# Altium project gydrodrive_control_board.PrjPcb (part 1 of 2)
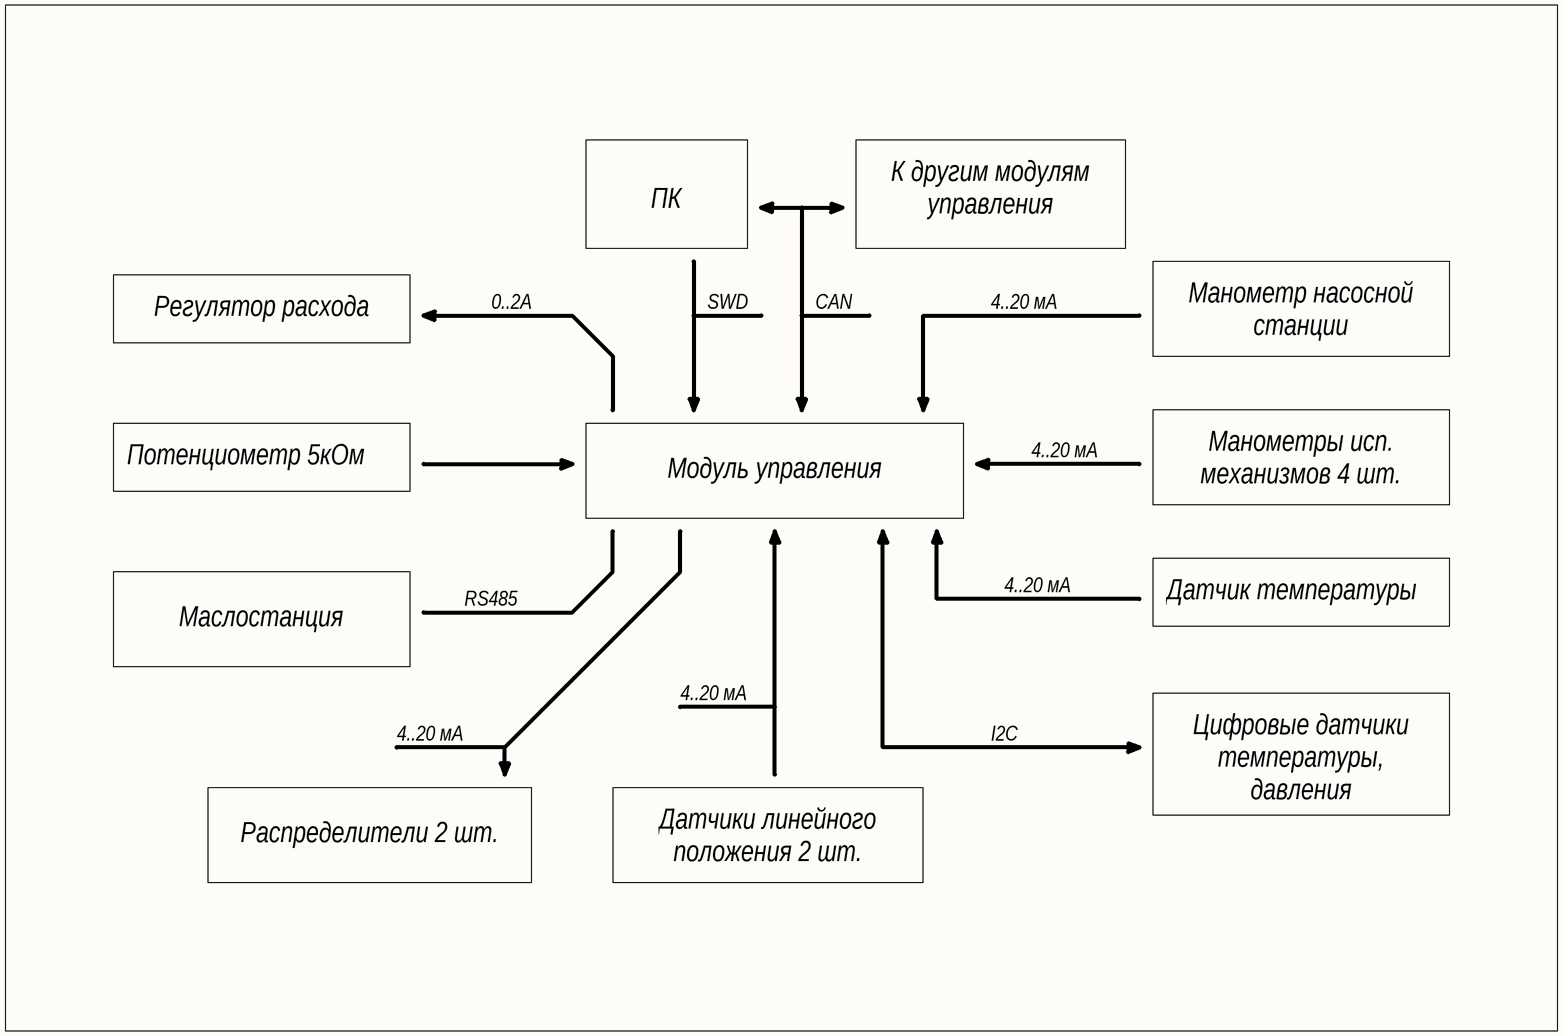
[diagram p0: gydrodrive_blockDiagram.SchDoc]
22 sheets, 283 parts. Net scope: strictly hierarchical (ports join the sheet entries above them; power ports are local).
Board file: gydrodrive_control_revA.PcbDoc
Sheets:
  gydrodrive_blockDiagram.SchDoc
  gydrodrive_main.SchDoc
    M = gydrodrive_mcu.SchDoc
    SP = gydrodrive_supply.SchDoc
    DB = gydrodrive_debugger.SchDoc
    B1 = gydrodrive_button.SchDoc
    B2 = gydrodrive_button.SchDoc
    B3 = gydrodrive_button.SchDoc
    B4 = gydrodrive_button.SchDoc
    B5 = gydrodrive_button.SchDoc
    B6 = gydrodrive_button.SchDoc
    P = gydrodrive_inputTrim.SchDoc
    C1 = gydrodrive_control.SchDoc
    C2 = gydrodrive_control.SchDoc
    IND = gydrodrive_indication.SchDoc
    D = gydrodrive_discreteControl.SchDoc
    S = gydrodrive_sto.SchDoc
    CS = gydrodrive_currentSource.SchDoc
    I = gydrodrive_interfaces.SchDoc
      I = gydrodrive_i2c.SchDoc
      U = gydrodrive_uart.SchDoc
      R = gydrodrive_rs485.SchDoc
      C = gydrodrive_can.SchDoc
    S = gydrodrive_sensors.SchDoc
      SPR1 = gydrodrive_sensor.SchDoc
      SPR2 = gydrodrive_sensor.SchDoc
      SPR3 = gydrodrive_sensor.SchDoc
      SPR4 = gydrodrive_sensor.SchDoc
      SPR5 = gydrodrive_sensor.SchDoc
      L1 = gydrodrive_linearPosSensor.SchDoc
      L2 = gydrodrive_linearPosSensor.SchDoc
      SPT = gydrodrive_sensor.SchDoc
    RS = gydrodrive_reservedPins.SchDoc
    EN = gydrodrive_encoder.SchDoc

## Sheet gydrodrive_blockDiagram.SchDoc
size A4; SheetNumber: 1; SheetTotal: 22

### Notes on the sheet
- ПК
- К другим модулям управления
- 0..2А
- SWD
- CAN
- 4..20 мА
- Регулятор расхода
- Манометр насосной станции
- Потенциометр 5кОм
- Модуль управления
- Манометры исп. механизмов 4 шт.
- RS485
- Датчик температуры
- Маслостанция
- I2C
- Цифровые датчики температуры, давления
- Распределители 2 шт.
- Датчики линейного положения 2 шт.

## Sheet gydrodrive_main.SchDoc
size 297 x 209 mm; SheetNumber: 2; SheetTotal: 22
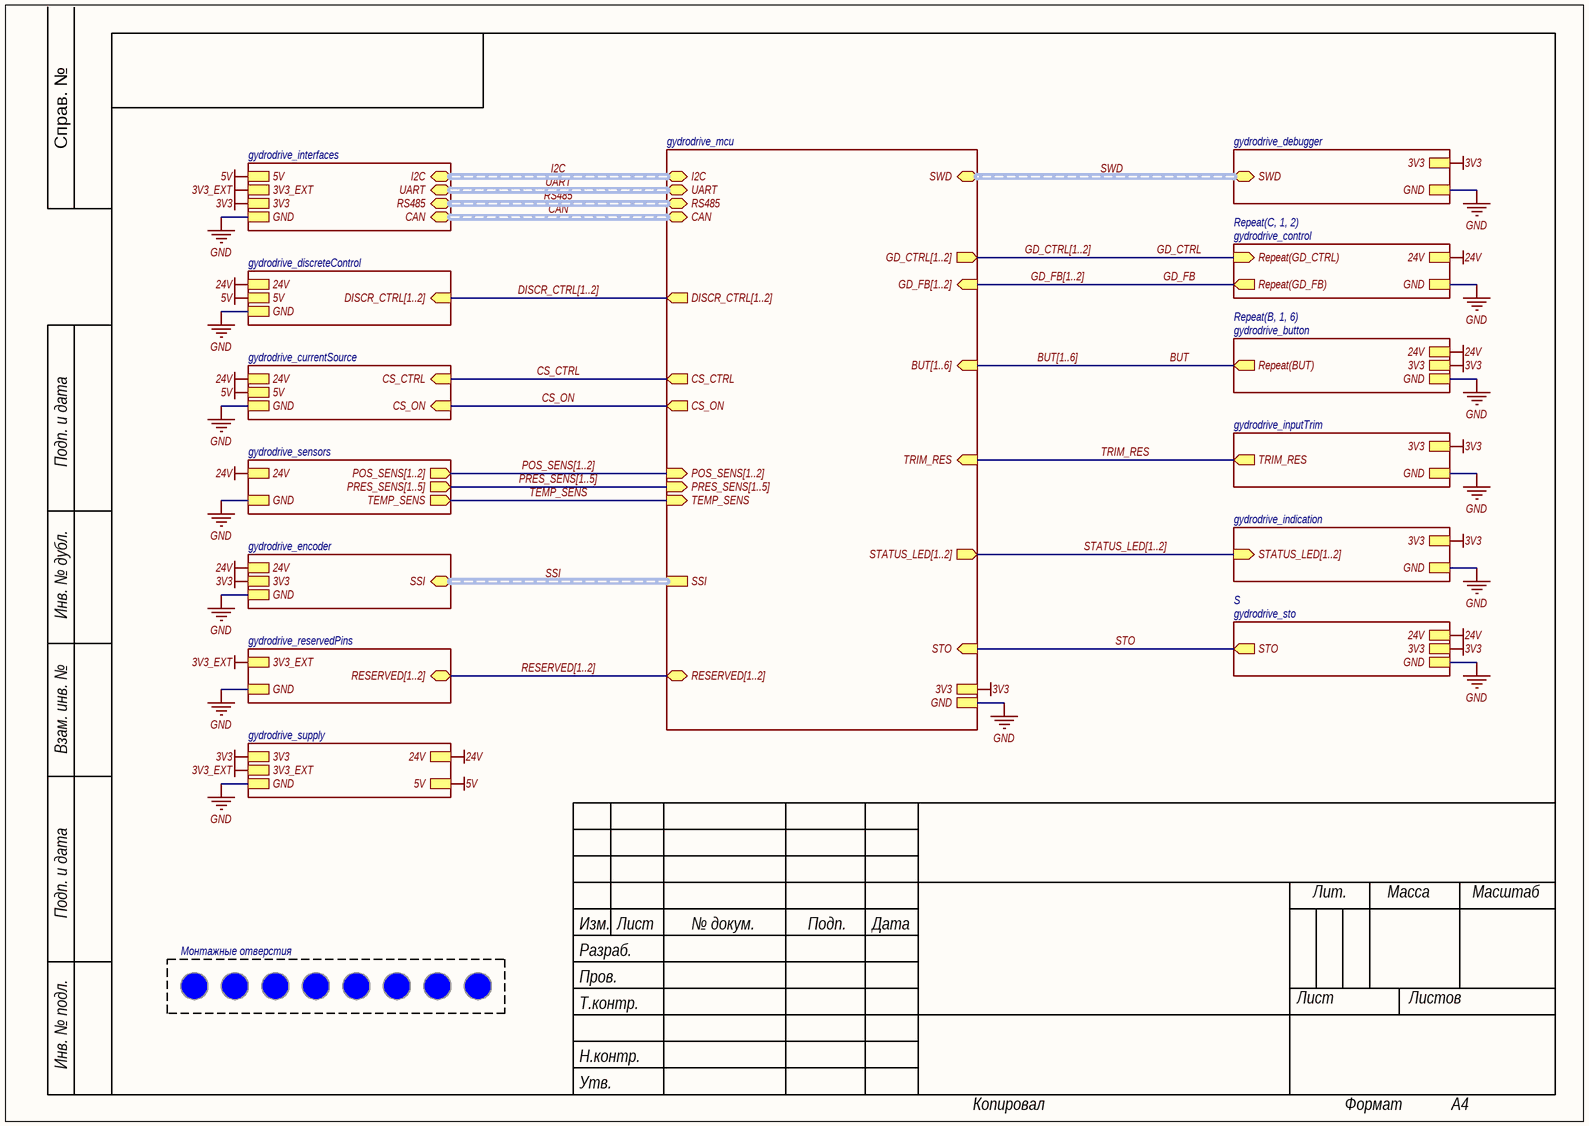
[diagram p1: gydrodrive_main.SchDoc]

### Parts
MH1  MH_3.2  [MH_3.2]  (value not drawn)  (no BOM)
MH2  MH_3.2  [MH_3.2]  (value not drawn)  (no BOM)
MH3  MH_3.2  [MH_3.2]  (value not drawn)  (no BOM)
MH4  MH_3.2  [MH_3.2]  (value not drawn)  (no BOM)
MH5  MH_3.2  [MH_3.2]  (value not drawn)  (no BOM)
MH6  MH_3.2  [MH_3.2]  (value not drawn)  (no BOM)
MH7  MH_3.2  [MH_3.2]  (value not drawn)  (no BOM)
MH8  MH_3.2  [MH_3.2]  (value not drawn)  (no BOM)

### Blocks framed on the sheet
Монтажные отверстия: MH1-MH8

### Sub-sheets
CS = gydrodrive_currentSource: CS_CTRL (in), 24V, GND, CS_ON (in), 5V
D = gydrodrive_discreteControl: 24V, GND, DISCR_CTRL[1..2] (in), 5V
DB = gydrodrive_debugger: SWD (bidir, harness SWD), GND, 3V3
EN = gydrodrive_encoder: SSI (bidir, harness SSI), 3V3, GND, 24V
I = gydrodrive_interfaces: CAN (bidir, harness CAN), RS485 (bidir, harness RS485), UART (bidir, harness UART), I2C (bidir, harness I2C), GND, 5V, 3V3, 3V3_EXT
IND = gydrodrive_indication: STATUS_LED[1..2] (in), GND, 3V3
M = gydrodrive_mcu: I2C (bidir, harness I2C), UART (bidir, harness UART), RS485 (bidir, harness RS485), CAN (bidir, harness CAN), TRIM_RES (in), BUT[1..6] (in), 3V3, GND, STATUS_LED[1..2] (out), STO (in), DISCR_CTRL[1..2] (out), SWD (bidir, harness SWD), GD_FB[1..2] (in), GD_CTRL[1..2] (out), CS_CTRL (out), POS_SENS[1..2] (in), PRES_SENS[1..5] (in), TEMP_SENS (in), CS_ON (out), RESERVED[1..2] (bidir), SSI (harness SSI)
P = gydrodrive_inputTrim: TRIM_RES (out), 3V3, GND
Repeat(B, 1, 6) = gydrodrive_button: Repeat(BUT) (out), 24V, GND, 3V3
Repeat(C, 1, 2) = gydrodrive_control: Repeat(GD_CTRL) (in), Repeat(GD_FB) (out), GND, 24V
RS = gydrodrive_reservedPins: GND, 3V3_EXT, RESERVED[1..2] (bidir)
S = gydrodrive_sto: STO (out), 24V, GND, 3V3
S = gydrodrive_sensors: PRES_SENS[1..5] (out), TEMP_SENS (out), POS_SENS[1..2] (out), 24V, GND
SP = gydrodrive_supply: 5V, GND, 3V3, 24V, 3V3_EXT

### Nets
3V3: sheet M/3V3, sheet SP/3V3, sheet DB/3V3, sheet Repeat(B, 1, 6)/3V3, sheet P/3V3, sheet IND/3V3, sheet S/3V3, sheet I/3V3, sheet EN/3V3
3V3_EXT: sheet SP/3V3_EXT, sheet I/3V3_EXT, sheet RS/3V3_EXT
5V: sheet SP/5V, sheet D/5V, sheet CS/5V, sheet I/5V
24V: sheet SP/24V, sheet Repeat(B, 1, 6)/24V, sheet Repeat(C, 1, 2)/24V, sheet D/24V, sheet S/24V, sheet CS/24V, sheet S/24V, sheet EN/24V
GND: sheet M/GND, sheet SP/GND, sheet DB/GND, sheet Repeat(B, 1, 6)/GND, sheet P/GND, sheet Repeat(C, 1, 2)/GND, sheet IND/GND, sheet D/GND, sheet S/GND, sheet CS/GND, sheet I/GND, sheet S/GND, sheet RS/GND, sheet EN/GND
BUT: sheet Repeat(B, 1, 6)/Repeat(BUT)
CS_CTRL: sheet M/CS_CTRL, sheet CS/CS_CTRL
CS_ON: sheet M/CS_ON, sheet CS/CS_ON
GD_CTRL: sheet Repeat(C, 1, 2)/Repeat(GD_CTRL)
GD_FB: sheet Repeat(C, 1, 2)/Repeat(GD_FB)
STO: sheet M/STO, sheet S/STO
TEMP_SENS: sheet M/TEMP_SENS, sheet S/TEMP_SENS
TRIM_RES: sheet M/TRIM_RES, sheet P/TRIM_RES

### Buses and harness runs
bus BUT[1..6] = sheet M/BUT[1..6]
bus DISCR_CTRL[1..2] = sheet D/DISCR_CTRL[1..2] = sheet M/DISCR_CTRL[1..2]
bus GD_CTRL[1..2] = sheet M/GD_CTRL[1..2]
bus GD_FB[1..2] = sheet M/GD_FB[1..2]
bus POS_SENS[1..2] = sheet M/POS_SENS[1..2] = sheet S/POS_SENS[1..2]
bus PRES_SENS[1..5] = sheet M/PRES_SENS[1..5] = sheet S/PRES_SENS[1..5]
bus RESERVED[1..2] = sheet M/RESERVED[1..2] = sheet RS/RESERVED[1..2]
bus STATUS_LED[1..2] = sheet IND/STATUS_LED[1..2] = sheet M/STATUS_LED[1..2]
harness CAN = sheet I/CAN = sheet M/CAN
harness I2C = sheet I/I2C = sheet M/I2C
harness RS485 = sheet I/RS485 = sheet M/RS485
harness SSI = sheet EN/SSI = sheet M/SSI
harness SWD = sheet DB/SWD = sheet M/SWD
harness UART = sheet I/UART = sheet M/UART

### Notes on the sheet
- Справ. №
- Подп. и дата
- Инв. № дубл.
- Взам. инв. №
- Изм.
- Лист
- № докум.
- Подп.
- Дата
- Лит.
- Масса
- Масштаб
- Разраб.
- Пров.
- Т.контр.
- Листов
- Инв. № подл.
- Н.контр.
- Утв.
- Копировал
- Формат
- A4

### Library data of the parts
MH1-MH8 = MH_3.2: Монтажное отверстие неметализированное 3.2 мм; Part Name: Монтажное отвертсие; Part Number: MH_3.2; Component Type: Standart (No BOM)

## Sheet gydrodrive_mcu.SchDoc
size 297 x 209 mm; SheetNumber: 3; SheetTotal: 22
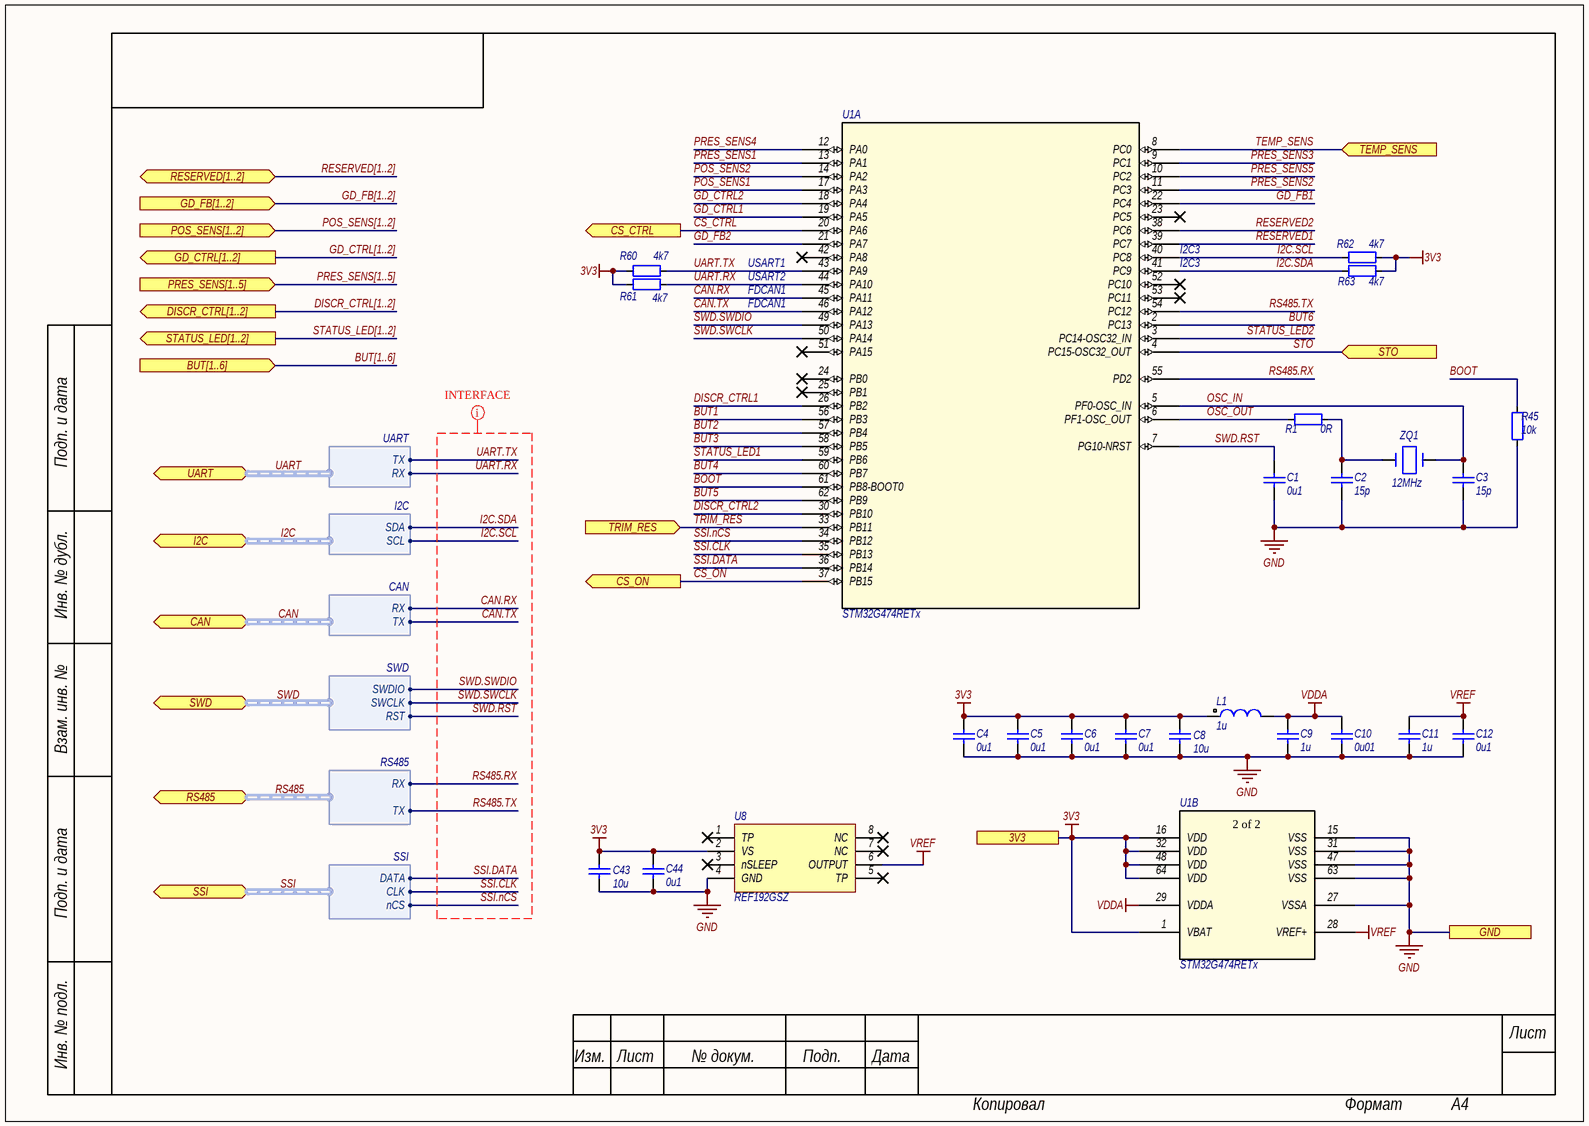
[diagram p2: gydrodrive_mcu.SchDoc]

### Parts
C1  Capacitance: 0u1  [CAPC2012-0805M]  (hidden comment: CAP_0805)
C2  Capacitance: 15p  [CAPC2012-0805M]  (hidden comment: CAP_0805)
C3  Capacitance: 15p  [CAPC2012-0805M]  (hidden comment: CAP_0805)
C4  Capacitance: 0u1  [CAPC2012-0805M]  (hidden comment: CAP_0805)
C5  Capacitance: 0u1  [CAPC2012-0805M]  (hidden comment: CAP_0805)
C6  Capacitance: 0u1  [CAPC2012-0805M]  (hidden comment: CAP_0805)
C7  Capacitance: 0u1  [CAPC2012-0805M]  (hidden comment: CAP_0805)
C8  Capacitance: 10u  [CAPC2012-0805M]  (hidden comment: CAP_0805)
C9  Capacitance: 1u  [CAPC2012-0805M]  (hidden comment: CAP_0805)
C10  Capacitance: 0u01  [CAPC2012-0805M]  (hidden comment: CAP_0805)
C11  Capacitance: 1u  [CAPC2012-0805M]  (hidden comment: CAP_0805)
C12  Capacitance: 0u1  [CAPC2012-0805M]  (hidden comment: CAP_0805)
C43  Capacitance: 10u  [CAPC2012-0805M]  (hidden comment: CAP_0805)
C44  Capacitance: 0u1  [CAPC2012-0805M]  (hidden comment: CAP_0805)
L1  Inductance: 1u  [INDC2012-0805M]  (hidden comment: IND_0805)
R1  Resistance: 0R  [RESC2012-0805M]  (hidden comment: RES_0805)
R45  Resistance: 10k  [RESC2012-0805M]  (hidden comment: RES_0805)
R60  Resistance: 4k7  [RESC2012-0805M]  (hidden comment: RES_0805)
R61  Resistance: 4k7  [RESC2012-0805M]  (hidden comment: RES_0805)
R62  Resistance: 4k7  [RESC2012-0805M]  (hidden comment: RES_0805)
R63  Resistance: 4k7  [RESC2012-0805M]  (hidden comment: RES_0805)
U1  STM32G474RETx  [LQFP50P1200X1200X160-64M]  (parts A,B of 2)
U8  REF192GSZ  [SO8_M]
ZQ1  Parameters: 12MHz  [HC-49SMD]  (hidden comment: QRZ_HC_49_SMD)

### Ports
3V3 (see gydrodrive_main[2C], gydrodrive_button[2B], gydrodrive_can[2B], gydrodrive_debugger[2B], gydrodrive_encoder[1A], gydrodrive_indication[3C], gydrodrive_inputTrim[2B], gydrodrive_interfaces[2C], gydrodrive_rs485[3B], gydrodrive_sto[2B], gydrodrive_supply[3C]), BUT[1..6] (in, see gydrodrive_main[3B]), CAN (bidir, harness CAN, see gydrodrive_main[2A], gydrodrive_can[1C], gydrodrive_interfaces[3D]), CS_CTRL (out, see gydrodrive_main[2B], gydrodrive_currentSource[3C]), CS_ON (out, see gydrodrive_main[2B], gydrodrive_currentSource[1C]), DISCR_CTRL[1..2] (out, see gydrodrive_main[2B], gydrodrive_discreteControl[1C]), GD_CTRL[1..2] (out, see gydrodrive_main[3A]), GD_FB[1..2] (in, see gydrodrive_main[3A]), GND (see gydrodrive_main[2D], gydrodrive_button[2C], gydrodrive_can[2C], gydrodrive_control[2C], gydrodrive_currentSource[1B], gydrodrive_debugger[3C], gydrodrive_discreteControl[2B], gydrodrive_encoder[1B], gydrodrive_i2c[3C], gydrodrive_indication[3C], gydrodrive_inputTrim[2C], gydrodrive_interfaces[2A], gydrodrive_linearPosSensor[2C], gydrodrive_reservedPins[2C], gydrodrive_rs485[2B], gydrodrive_sensor[2C], gydrodrive_sensors[1B], gydrodrive_sto[2C], gydrodrive_supply[2C], gydrodrive_uart[2C]), I2C (bidir, harness I2C, see gydrodrive_main[2A], gydrodrive_i2c[1C], gydrodrive_interfaces[3A]), POS_SENS[1..2] (in, see gydrodrive_main[2B], gydrodrive_sensors[3B]), PRES_SENS[1..5] (in, see gydrodrive_main[2B], gydrodrive_sensors[3B]), RESERVED[1..2] (bidir, see gydrodrive_main[3C], gydrodrive_reservedPins[2B]), RS485 (bidir, harness RS485, see gydrodrive_main[2A], gydrodrive_interfaces[3C], gydrodrive_rs485[1B]), SSI (bidir, harness SSI, see gydrodrive_main[3D], gydrodrive_encoder[1D]), STATUS_LED[1..2] (out, see gydrodrive_main[3B], gydrodrive_indication[2B]), STO (in, see gydrodrive_main[3C], gydrodrive_sto[2B]), SWD (bidir, harness SWD, see gydrodrive_main[3A], gydrodrive_debugger[1B]), TEMP_SENS (in, see gydrodrive_main[2C], gydrodrive_sensors[3C]), TRIM_RES (in, see gydrodrive_main[3B], gydrodrive_inputTrim[2C]), UART (bidir, harness UART, see gydrodrive_main[2A], gydrodrive_interfaces[3B], gydrodrive_uart[2B])

### Harnesses
UART: RX, TX
CAN: TX, RX
I2C: SDA, SCL
SWD: SWDIO, SWCLK, RST
SSI: DATA, CLK, nCS
RS485: RX, TX

### Nets
3V3: C4.2 C5.2 C6.2 C7.2 C8.2 C43.2 C44.2 L1.1 R60.2 R61.2 R62.1 R63.1 U1.1(VBAT) U1.16(VDD) U1.32(VDD) U1.48(VDD) U1.64(VDD) U8.2(VS) ; port 3V3
GND: C1.1 C2.1 C3.1 C4.1 C5.1 C6.1 C7.1 C8.1 C9.1 C10.1 C11.1 C12.1 C43.1 C44.1 R45.1 U1.15(VSS) U1.27(VSSA) U1.31(VSS) U1.47(VSS) U1.63(VSS) U8.4(GND) ; port GND
VDDA: C9.2 C10.2 L1.2 U1.29(VDDA)
VREF: C11.2 C12.2 U1.28(VREF+) U8.6(OUTPUT)
BOOT: R45.2 U1.61(PB8-BOOT0)
BUT1: U1.56(PB3)
BUT2: U1.57(PB4)
BUT3: U1.58(PB5)
BUT4: U1.60(PB7)
BUT5: U1.62(PB9)
BUT6: U1.2(PC13)
CAN.RX: U1.45(PA11) ; port CAN.RX
CAN.TX: U1.46(PA12) ; port CAN.TX
CS_CTRL: U1.20(PA6) ; port CS_CTRL
CS_ON: U1.37(PB15) ; port CS_ON
DISCR_CTRL1: U1.26(PB2)
DISCR_CTRL2: U1.30(PB10)
GD_CTRL1: U1.19(PA5)
GD_CTRL2: U1.18(PA4)
GD_FB1: U1.22(PC4)
GD_FB2: U1.21(PA7)
I2C.SCL: R62.2 U1.40(PC8) ; port I2C.SCL
I2C.SDA: R63.2 U1.41(PC9) ; port I2C.SDA
OSC_IN: C3.2 U1.5(PF0-OSC_IN) ZQ1.2
OSC_OUT: R1.1 U1.6(PF1-OSC_OUT)
POS_SENS1: U1.17(PA3)
POS_SENS2: U1.14(PA2)
PRES_SENS1: U1.13(PA1)
PRES_SENS2: U1.11(PC3)
PRES_SENS3: U1.9(PC1)
PRES_SENS4: U1.12(PA0)
PRES_SENS5: U1.10(PC2)
RESERVED1: U1.39(PC7)
RESERVED2: U1.38(PC6)
RS485.RX: U1.55(PD2) ; port RS485.RX
RS485.TX: U1.54(PC12) ; port RS485.TX
SSI.CLK: U1.35(PB13) ; port SSI.CLK
SSI.DATA: U1.36(PB14) ; port SSI.DATA
SSI.nCS: U1.34(PB12) ; port SSI.nCS
STATUS_LED1: U1.59(PB6)
STATUS_LED2: U1.3(PC14-OSC32_IN)
STO: U1.4(PC15-OSC32_OUT) ; port STO
SWD.RST: C1.2 U1.7(PG10-NRST) ; port SWD.RST
SWD.SWCLK: U1.50(PA14) ; port SWD.SWCLK
SWD.SWDIO: U1.49(PA13) ; port SWD.SWDIO
TEMP_SENS: U1.8(PC0) ; port TEMP_SENS
TRIM_RES: U1.33(PB11) ; port TRIM_RES
UART.RX: R61.1 U1.44(PA10) ; port UART.RX
UART.TX: R60.1 U1.43(PA9) ; port UART.TX
NetC2_2: C2.2 R1.2 ZQ1.1

Not connected (* = marked no-connect by the designer): U1 23(PC5)* 24(PB0)* 25(PB1)* 42(PA8)* 51(PA15)* 52(PC10)* 53(PC11)*; U8 1(TP)* 3(nSLEEP)* 5(TP)* 7(NC)* 8(NC)*

### Buses and harness runs
bus BUT[1..6] = port BUT[1..6]
bus DISCR_CTRL[1..2] = port DISCR_CTRL[1..2]
bus GD_CTRL[1..2] = port GD_CTRL[1..2]
bus GD_FB[1..2] = port GD_FB[1..2]
bus POS_SENS[1..2] = port POS_SENS[1..2]
bus PRES_SENS[1..5] = port PRES_SENS[1..5]
bus RESERVED[1..2] = port RESERVED[1..2]
bus STATUS_LED[1..2] = port STATUS_LED[1..2]
harness CAN = port CAN
harness I2C = port I2C
harness RS485 = port RS485
harness SSI = port SSI
harness SWD = port SWD
harness UART = port UART

### Layout directives
net class INTERFACE: CAN.RX, CAN.TX, I2C.SCL, I2C.SDA, RS485.RX, RS485.TX, SSI.CLK, SSI.DATA, SSI.nCS, SWD.RST, SWD.SWCLK, SWD.SWDIO, UART.RX, UART.TX

### Notes on the sheet
- USART1
- (near U1) I2C3
- FDCAN1
- USART2
- Подп. и дата
- Инв. № дубл.
- Взам. инв. №
- Инв. № подл.
- Изм.
- Лист
- № докум.
- Подп.
- Дата
- Копировал
- Формат
- A4
- (in symbol STM32G474RETx, part B) 2 of 2

### Library data of the parts
C1 C4-C7 C12 C44 = CAPC_0805: Конденсатор керамический, корпус 0805; Parameters: 0u1,  50V; Voltage: 50V; Max Price: 5; Part Number: CAPC_0805; Part Name: ='Конд-р керам. 0805,  '  + Parameters; Component Type: Standart; Pin Count: 2
C2 C3 = CAPC_0805: Конденсатор керамический, корпус 0805; Parameters: 15p,  50V; Voltage: 50V; Max Price: 5; Part Number: CAPC_0805; Part Name: ='Конд-р керам. 0805,  '  + Parameters; Component Type: Standart; Pin Count: 2
C8 C43 = CAPC_0805: Конденсатор керамический, корпус 0805; Parameters: 10u,  16V; Voltage: 16V; Max Price: 5; Part Number: CAPC_0805; Part Name: ='Конд-р керам. 0805,  '  + Parameters; Component Type: Standart; Pin Count: 2
C9 C11 = CAPC_0805: Конденсатор керамический, корпус 0805; Parameters: 1u,  50V; Voltage: 50V; Max Price: 5; Part Number: CAPC_0805; Part Name: ='Конд-р керам. 0805,  '  + Parameters; Component Type: Standart; Pin Count: 2
C10 = CAPC_0805: Конденсатор керамический, корпус 0805; Parameters: 0u01,  50V; Voltage: 50V; Max Price: 5; Part Number: CAPC_0805; Part Name: ='Конд-р керам. 0805,  '  + Parameters; Component Type: Standart; Pin Count: 2
L1 = INDC_0805: Индуктивность, корпус 0805; Part Name: Индуктивность smd 0805; Parameters: 1u, 100mA; Current: 100mA; Max Price: 15; Part Number: INDC_0805; Component Type: Standart; Pin Count: 2
R1 = RESC_0805: Рез-р, корпус 0805; Tolerance: 5%; Parameters: 0R, 5%; Max Price: 3; Part Number: RESC_0805; Part Name: ='Рез-р 0805, ' + Parameters; Component Type: Standart
R45 = RESC_0805: Рез-р, корпус 0805; Tolerance: 5%; Parameters: 10k, 5%; Max Price: 3; Part Number: RESC_0805; Part Name: ='Рез-р 0805, ' + Parameters; Component Type: Standart
R60-R63 = RESC_0805: Рез-р, корпус 0805; Tolerance: 5%; Parameters: 4k7, 5%; Max Price: 3; Part Number: RESC_0805; Part Name: ='Рез-р 0805, ' + Parameters; Component Type: Standart
U1 = STM32G474RETx: Mainstream Arm Cortex-M4 core with DSP and FPU, 170MHz with 512Kbytes of Flash memory, Math Accelerator, HR Timer, High Analog level integration; Manufacturer_Part_Number: stm32g4_lqfp64_t1; Built_By: EMA_Jessica; Vendor: STMicroelectronics; Copyright: Copyright (C) 2016 Accelerated Designs. All rights reserved; RefDes: RefDes; Type: DEV; Value: Value
U8 = REF192GSZ: Источник опорного напряжения, 2.5 В; Part Name: Микросхема REF192GSZ; Parameters: 2.5V, 0.4%; Voltage: 2.5V; Tolerance: 0.4%; Max Price: 300; Part Number: REF192GSZ; Component Type: Standart
ZQ1 = QRZ_HC_49_SMD: Кварцевый резонатор в корпусе HC-49 SMD; Part Name: Кварц. Рез-р HC-49S, 12MHz; Max Price: 50; Part Number: QRZ_HC_49_SMD; Component Type: Standart

## Sheet gydrodrive_supply.SchDoc
size 297 x 209 mm; SheetNumber: 4; SheetTotal: 22
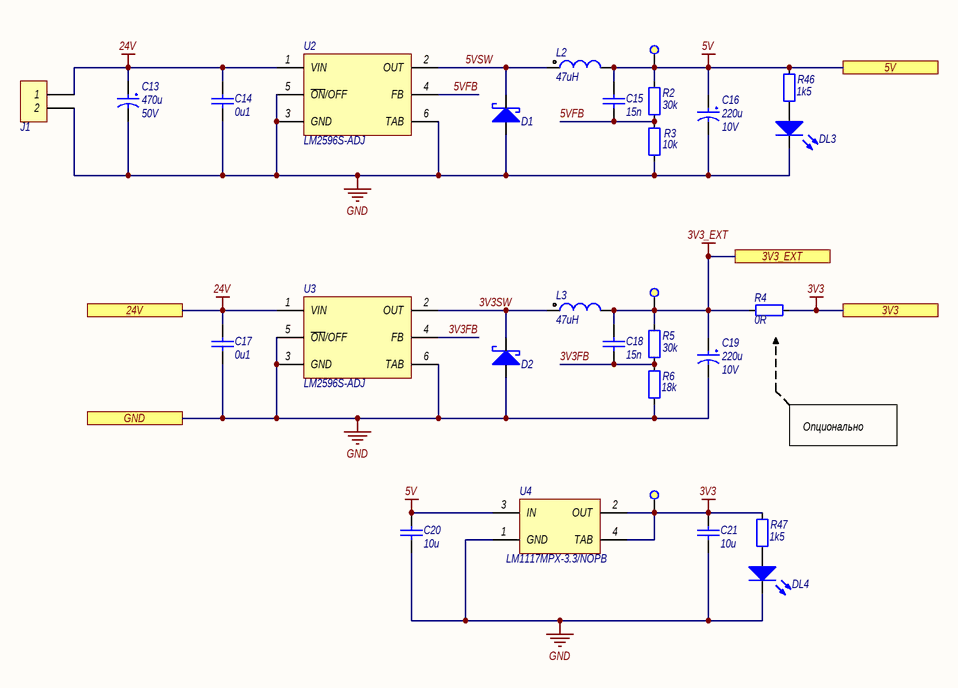
[diagram p3: gydrodrive_supply.SchDoc]

### Parts
C13  Capacitance: 470u  Voltage: 50V  [ECAP1020]  (hidden comment: JRB1H471M05001000200000B)
C14  Capacitance: 0u1  [CAPC2012-0805M]  (hidden comment: CAP_0805)
C15  Capacitance: 15n  [CAPC2012-0805M]  (hidden comment: CAP_0805)
C16  Capacitance: 220u  Voltage: 10V  [ECAP6.37]  (hidden comment: JRK1A221M02500630070000B)
C17  Capacitance: 0u1  [CAPC2012-0805M]  (hidden comment: CAP_0805)
C18  Capacitance: 15n  [CAPC2012-0805M]  (hidden comment: CAP_0805)
C19  Capacitance: 220u  Voltage: 10V  [ECAP6.37]  (hidden comment: JRK1A221M02500630070000B)
C20  Capacitance: 10u  [CAPC2012-0805M]  (hidden comment: CAP_0805)
C21  Capacitance: 10u  [CAPC2012-0805M]  (hidden comment: CAP_0805)
D1  SK56  [SMB_M]  (value not drawn)
D2  SK56  [SMB_M]  (value not drawn)
DL3  LED_0805  [LEDC2012-0805M]  (value not drawn)
DL4  LED_0805  [LEDC2012-0805M]  (value not drawn)
J1  DG142V-5.08-02P  [DG142V-5.08-02P]  (value not drawn)
L2  Inductance: 47uH  [IND_IHL4040_M]  (hidden comment: IHLP4040DZER470M11)
L3  Inductance: 47uH  [IND_IHL4040_M]  (hidden comment: IHLP4040DZER470M11)
R2  Resistance: 30k  [RESC2012-0805M]  (hidden comment: RES_0805)
R3  Resistance: 10k  [RESC2012-0805M]  (hidden comment: RES_0805)
R4  Resistance: 0R  [RESC2012-0805M]  (hidden comment: RES_0805)
R5  Resistance: 30k  [RESC2012-0805M]  (hidden comment: RES_0805)
R6  Resistance: 18k  [RESC2012-0805M]  (hidden comment: RES_0805)
R46  Resistance: 1k5  [RESC2012-0805M]  (hidden comment: RES_0805)
R47  Resistance: 1k5  [RESC2012-0805M]  (hidden comment: RES_0805)
TP2  Test point 2  [TP_2]  (value not drawn)  (no BOM)
TP3  Test point 2  [TP_2]  (value not drawn)  (no BOM)
TP4  Test point 2  [TP_2]  (value not drawn)  (no BOM)
U2  LM2596S-ADJ  [TO-263-5M]
U3  LM2596S-ADJ  [TO-263-5M]
U4  LM1117MPX-3.3/NOPB  [SOT223M]

### Ports
3V3 (see gydrodrive_main[1C], gydrodrive_button[2B], gydrodrive_can[3B], gydrodrive_debugger[2B], gydrodrive_encoder[1A], gydrodrive_indication[3C], gydrodrive_inputTrim[2B], gydrodrive_interfaces[3C], gydrodrive_mcu[4C], gydrodrive_rs485[4B], gydrodrive_sto[2B]), 3V3_EXT (see gydrodrive_main[1C], gydrodrive_i2c[5B], gydrodrive_interfaces[3A], gydrodrive_reservedPins[2B], gydrodrive_uart[4B]), 5V (see gydrodrive_main[1C], gydrodrive_can[4B], gydrodrive_currentSource[2C], gydrodrive_discreteControl[3B], gydrodrive_interfaces[3C]), 24V (see gydrodrive_main[1C], gydrodrive_button[2B], gydrodrive_control[2B], gydrodrive_currentSource[2B], gydrodrive_discreteControl[4B], gydrodrive_encoder[3B], gydrodrive_linearPosSensor[3B], gydrodrive_sensor[3B], gydrodrive_sensors[2B], gydrodrive_sto[3B]), GND (see gydrodrive_main[1C], gydrodrive_button[2C], gydrodrive_can[3C], gydrodrive_control[2C], gydrodrive_currentSource[2B], gydrodrive_debugger[3C], gydrodrive_discreteControl[3B], gydrodrive_encoder[1B], gydrodrive_i2c[5C], gydrodrive_indication[3C], gydrodrive_inputTrim[2C], gydrodrive_interfaces[3A], gydrodrive_linearPosSensor[2C], gydrodrive_mcu[6D], gydrodrive_reservedPins[2C], gydrodrive_rs485[3B], gydrodrive_sensor[3C], gydrodrive_sensors[2B], gydrodrive_sto[2C], gydrodrive_uart[4C])

### Nets
3V3: C21.2 R4.1 R47.2 TP4.1 U4.2(OUT) U4.4(TAB) ; port 3V3
3V3_EXT: C18.1 C19.1 L3.2 R4.2 R5.2 TP3.1 ; port 3V3_EXT
5V: C15.1 C16.1 C20.2 L2.2 R2.2 R46.2 TP2.1 U4.3(IN) ; port 5V
24V: C13.1 C14.2 C17.2 J1.1 U2.1(VIN) U3.1(VIN) ; port 24V
GND: C13.2 C14.1 C16.2 C17.1 C19.2 C20.1 C21.1 D1.2(A) D2.2(A) DL3.1(K) DL4.1(K) J1.2 R3.1 R6.1 U2.3(GND) U2.5(~{ON}/OFF) U2.6(TAB) U3.3(GND) U3.5(~{ON}/OFF) U3.6(TAB) U4.1(GND) ; port GND
3V3FB: C18.2 R5.1 R6.2 U3.4(FB)
3V3SW: D2.1(K) L3.1 U3.2(OUT)
5VFB: C15.2 R2.1 R3.2 U2.4(FB)
5VSW: D1.1(K) L2.1 U2.2(OUT)
NetDL3_2: DL3.2(A) R46.1
NetDL4_2: DL4.2(A) R47.1

### Notes on the sheet
- Опционально
- Подп. и дата
- Инв. № дубл.
- Взам. инв. №
- Инв. № подл.
- Изм.
- Лист
- № докум.
- Подп.
- Дата
- Копировал
- Формат
- A4

### Library data of the parts
C13 = JRB1H471M05001000200000B: Конденсатор электролитический; Part Name: Конд-р электрол.  JRB1H471M05001000200000B, 470uF, 50V; Parameters: 470uF, 50V; Max Price: 30; Part Number: JRB1H471M05001000200000B; Component Type: Standart
C14 C17 = CAPC_0805: as C1 on sheet gydrodrive_mcu; Part Number: CAPC_0805; Part Name: ='Конд-р керам. 0805,  '  + Parameters; Component Type: Standart; Pin Count: 2
C15 C18 = CAPC_0805: Конденсатор керамический, корпус 0805; Parameters: 15n,  50V; Voltage: 50V; Max Price: 5; Part Number: CAPC_0805; Part Name: ='Конд-р керам. 0805,  '  + Parameters; Component Type: Standart; Pin Count: 2
C16 C19 = JRK1A221M02500630070000B: Конденсатор электролитический; Part Name: Конд-р электрол.  JRK1A221M02500630070000B, 220uF, 10V; Parameters: 220uF, 10V; Max Price: 20; Part Number: JRK1A221M02500630070000B; Component Type: Standart
C20 C21 = CAPC_0805: as C8 on sheet gydrodrive_mcu; Part Number: CAPC_0805; Part Name: ='Конд-р керам. 0805,  '  + Parameters; Component Type: Standart; Pin Count: 2
D1 D2 = SK56: Диод Шоттки; Part Name: Диод Шоттки SK56; Parameters: 60V, 5A; Voltage: 60V; Current: 5A; Max Price: 50; Part Number: SK56; Component Type: Standart; Pin Count: 2
DL3 DL4 = LED_0805: Светодиод smd, корпус 0805; Part Name: Светодиод smd 0805; Parameters: Желтый; Max Price: 0; Part Number: LED_0805; Component Type: Standart; Pin Count: 2
J1 = DG142V-5.08-02P: Клеммник 2-контактный, шаг 5.08 мм; Part Name: Клеммник DG142V-5.08-02P; Parameters: 8А; Max Price: 60; System: Connector; Part Number: DG142V-5.08-02P; Component Type: Standart; Pin Count: 2
L2 L3 = IHLP4040DZER470M11: Индуктивность силовая; Part Name: Индуктивность IHLP4040DZER470M11; Current: 3A; Max Price: 100; Part Number: IHLP4040DZER470M11; Component Type: Standart; Pin Count: 2; Parameters: 47uH
R2 R5 = RESC_0805: Рез-р, корпус 0805; Tolerance: 5%; Parameters: 30k, 5%; Max Price: 3; Part Number: RESC_0805; Part Name: ='Рез-р 0805, ' + Parameters; Component Type: Standart
R3 = RESC_0805: as R45 on sheet gydrodrive_mcu; Part Number: RESC_0805; Part Name: ='Рез-р 0805, ' + Parameters; Component Type: Standart
R4 = RESC_0805: as R1 on sheet gydrodrive_mcu; Part Number: RESC_0805; Part Name: ='Рез-р 0805, ' + Parameters; Component Type: Standart
R6 = RESC_0805: Рез-р, корпус 0805; Tolerance: 5%; Parameters: 18k, 5%; Max Price: 3; Part Number: RESC_0805; Part Name: ='Рез-р 0805, ' + Parameters; Component Type: Standart
R46 R47 = RESC_0805: Рез-р, корпус 0805; Tolerance: 5%; Parameters: 1k5, 5%; Max Price: 3; Part Number: RESC_0805; Part Name: ='Рез-р 0805, ' + Parameters; Component Type: Standart
TP2-TP4 = Test point 2: Тестовый контакт круглый 2 мм; Part Number: Test point 2; Part Name: Тестовый контакт; Component Type: Standart (No BOM)
U2 U3 = LM2596S-ADJ: DC-DC преобразователь; Part Name: DC-DC преобразователь LM2596S-ADJ; Parameters: 40V, 1.23..37V, 3A, 150kHz; Max Price: 600; ComponentLink1Description: LM2596 Datasheet; ComponentLink1URL: http://www.national.com/ds/LM/LM2596.pdf; ComponentLink3Description: TS5B Package Page; ComponentLink3URL: http://www.national.com/packaging/folders/ts5b.html; Part Number: LM2596S-ADJ; Component Type: Standart; HelpURL: https://www.ti.com/lit/ds/symlink/lm2596.pdf
U4 = LM1117MPX-3.3/NOPB: Линейный регулятор с низким падением напряжения; Part Name: Линейный регулятор LM1117MPX-3.3/NOPB; Parameters: 3.3V, 800mA; Max Price: 250; Part Number: LM1117MPX-3.3/NOPB; Component Type: Standart; Pin Count: 4; HelpURL: https://static.chipdip.ru/lib/666/DOC012666144.pdf

## Sheet gydrodrive_debugger.SchDoc
size 297 x 209 mm; SheetNumber: 9; SheetTotal: 22
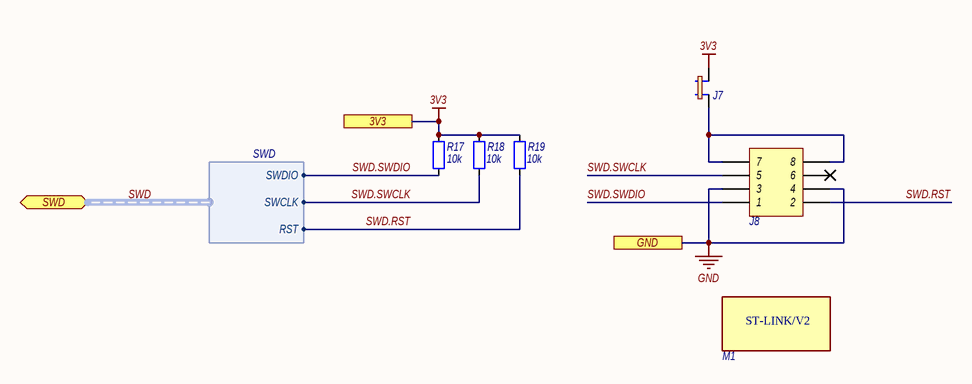
[diagram p4: gydrodrive_debugger.SchDoc]

### Parts
J7  PLS-2.54-2 JUMP  [PLS-2-2.54]  (value not drawn)
J8  PBD-2.54-08R  [PBD-8R]  (value not drawn)
M1  ST-LINK/V2  [ST_LINK_V2_MINI]  (value not drawn)
R17  Resistance: 10k  [RESC2012-0805M]  (hidden comment: RES_0805)
R18  Resistance: 10k  [RESC2012-0805M]  (hidden comment: RES_0805)
R19  Resistance: 10k  [RESC2012-0805M]  (hidden comment: RES_0805)

### Ports
3V3 (see gydrodrive_main[4A], gydrodrive_button[2B], gydrodrive_can[3B], gydrodrive_encoder[1A], gydrodrive_indication[3C], gydrodrive_inputTrim[2B], gydrodrive_interfaces[3C], gydrodrive_mcu[4C], gydrodrive_rs485[4B], gydrodrive_sto[2B], gydrodrive_supply[5B]), GND (see gydrodrive_main[4A], gydrodrive_button[2C], gydrodrive_can[3C], gydrodrive_control[2C], gydrodrive_currentSource[2B], gydrodrive_discreteControl[3B], gydrodrive_encoder[1B], gydrodrive_i2c[5C], gydrodrive_indication[3C], gydrodrive_inputTrim[2C], gydrodrive_interfaces[3A], gydrodrive_linearPosSensor[2C], gydrodrive_mcu[6D], gydrodrive_reservedPins[2C], gydrodrive_rs485[3B], gydrodrive_sensor[3C], gydrodrive_sensors[2B], gydrodrive_sto[2C], gydrodrive_supply[2C], gydrodrive_uart[4C]), SWD (bidir, harness SWD, see gydrodrive_main[3A], gydrodrive_mcu[1C])

### Harnesses
SWD: SWDIO, SWCLK, RST

### Nets
3V3: J7.2 R17.2 R18.2 R19.2 ; port 3V3
GND: J8.3 J8.4 ; port GND
SWD.RST: J8.2 R19.1 ; port SWD.RST
SWD.SWCLK: J8.5 R18.1 ; port SWD.SWCLK
SWD.SWDIO: J8.1 R17.1 ; port SWD.SWDIO
NetJ7_1: J7.1 J8.7 J8.8

Not connected (* = marked no-connect by the designer): J8 6*

### Buses and harness runs
harness SWD = port SWD

### Notes on the sheet
- Подп. и дата
- Инв. № дубл.
- Взам. инв. №
- Инв. № подл.
- Изм.
- Лист
- № докум.
- Подп.
- Дата
- Копировал
- Формат
- A4

### Library data of the parts
J7 = PLS-2.54-2 JUMP: Разъем штыревой шаг 2.54 мм; Part Name: Разъем PLS-2, шаг 2.54 мм; Parameters: 2.54 мм; Max Price: 10; System: Connector; Part Number: PLS-2.54-2 JUMP; Component Type: Standart; Pin Count: 2
J8 = PBD-2.54-08R: Разъем; Part Name: Разъем PBD-8R, шаг 2.54 мм; Parameters: 2.54 мм; Max Price: 0; System: Connector; Part Number: PBD-2.54-08R; Component Type: Standart; Pin Count: 8
M1 = ST-LINK/V2: Программатор; Part Name: Программатор ST-LINK/V2 (mini) Waveshare 10053; Max Price: 2000; Part Number: ST-LINK/V2; Component Type: Standart
R17-R19 = RESC_0805: as R45 on sheet gydrodrive_mcu; Part Number: RESC_0805; Part Name: ='Рез-р 0805, ' + Parameters; Component Type: Standart

## Sheet gydrodrive_button.SchDoc
size 297 x 209 mm; SheetNumber: 6; SheetTotal: 22
Used 6 times, as channels B1, B2, B3, B4, B5, B6. Parts and nets are listed once, with the designators drawn on the sheet.
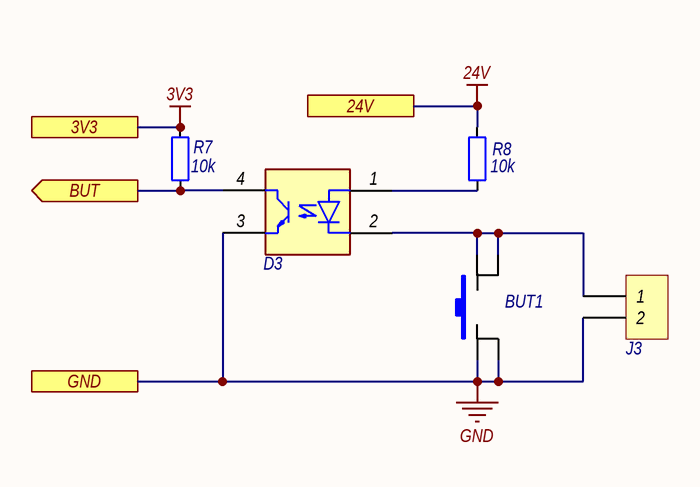
[diagram p5: gydrodrive_button.SchDoc]

### Parts
BUT1  KLS7-TS6604-4.3-180  [SWITCH_6x6_SMD]  (value not drawn)
D3  LTV-817S  [DIP-4-SMD]  (value not drawn)
J3  DG142V-5.08-02P  [DG142V-5.08-02P]  (value not drawn)
R7  Resistance: 10k  [RESC2012-0805M]  (hidden comment: RES_0805)
R8  Resistance: 10k  [RESC2012-0805M]  (hidden comment: RES_0805)

### Ports
3V3 (see gydrodrive_main[4B], gydrodrive_can[3B], gydrodrive_debugger[3B], gydrodrive_encoder[1A], gydrodrive_indication[3C], gydrodrive_inputTrim[2B], gydrodrive_interfaces[3C], gydrodrive_mcu[4C], gydrodrive_rs485[4B], gydrodrive_sto[2B], gydrodrive_supply[5B]), 24V (see gydrodrive_main[4B], gydrodrive_control[4B], gydrodrive_currentSource[2B], gydrodrive_discreteControl[4B], gydrodrive_encoder[3B], gydrodrive_linearPosSensor[3B], gydrodrive_sensor[3B], gydrodrive_sensors[2B], gydrodrive_sto[3B], gydrodrive_supply[2B]), BUT (out, see gydrodrive_main[3B]), GND (see gydrodrive_main[4B], gydrodrive_can[3C], gydrodrive_control[3B], gydrodrive_currentSource[2B], gydrodrive_debugger[4C], gydrodrive_discreteControl[3B], gydrodrive_encoder[1B], gydrodrive_i2c[5C], gydrodrive_indication[3C], gydrodrive_inputTrim[2C], gydrodrive_interfaces[3A], gydrodrive_linearPosSensor[2C], gydrodrive_mcu[6D], gydrodrive_reservedPins[2C], gydrodrive_rs485[3B], gydrodrive_sensor[3C], gydrodrive_sensors[2B], gydrodrive_sto[2C], gydrodrive_supply[2C], gydrodrive_uart[4C])

### Nets
3V3: R7.2 ; port 3V3
24V: R8.2 ; port 24V
GND: BUT1.3 BUT1.4 D3.3(C) J3.2 ; port GND
BUT: D3.4(A) R7.1 ; port BUT
NetBUT1_1: BUT1.1 BUT1.2 D3.2(E) J3.1
NetD3_1: D3.1(K) R8.1

### Channels
B1: designators end in _1; ports 3V3=3V3 24V=24V BUT=BUT1 GND=GND
B2: designators end in _2; ports 3V3=3V3 24V=24V BUT=BUT2 GND=GND
B3: designators end in _3; ports 3V3=3V3 24V=24V BUT=BUT3 GND=GND
B4: designators end in _4; ports 3V3=3V3 24V=24V BUT=BUT4 GND=GND
B5: designators end in _5; ports 3V3=3V3 24V=24V BUT=BUT5 GND=GND
B6: designators end in _6; ports 3V3=3V3 24V=24V BUT=BUT6 GND=GND

### Notes on the sheet
- Подп. и дата
- Инв. № дубл.
- Взам. инв. №
- Инв. № подл.
- Изм.
- Лист
- № докум.
- Подп.
- Дата
- Копировал
- Формат
- A4

### Library data of the parts
BUT1 = KLS7-TS6604-4.3-180: Тактовая кнопка SMD; Part Name: Тактовая кнопка KLS7-TS6604-4.3-180; Parameters: 4.3мм; Max Price: 20; Part Number: KLS7-TS6604-4.3-180; Component Type: Standart
D3 = LTV-817S: Оптопара транзисторная одноканальная; Part Name: Оптопара транзисторная LTV-817S; Max Price: 50; Part Number: LTV-817S; Component Type: Standart
J3 = DG142V-5.08-02P: as J1 on sheet gydrodrive_supply; Part Number: DG142V-5.08-02P; Component Type: Standart; Pin Count: 2
R7 R8 = RESC_0805: as R45 on sheet gydrodrive_mcu; Part Number: RESC_0805; Part Name: ='Рез-р 0805, ' + Parameters; Component Type: Standart

## Sheet gydrodrive_inputTrim.SchDoc
size 297 x 209 mm; SheetNumber: 5; SheetTotal: 22
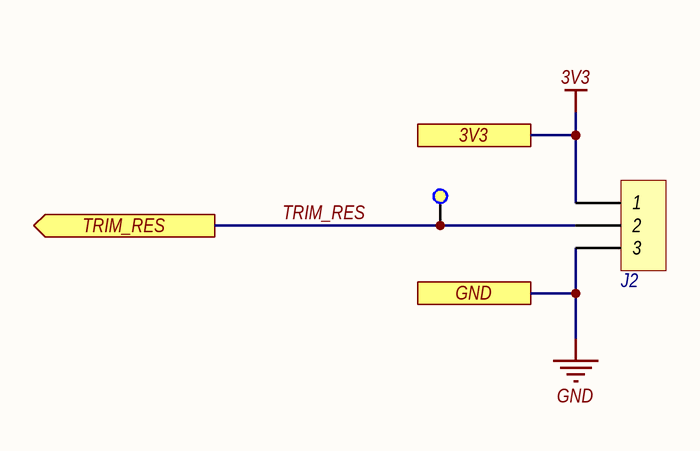
[diagram p6: gydrodrive_inputTrim.SchDoc]

### Parts
J2  DG142V-5.08-03P  [DG142V-5.08-03P]  (value not drawn)
TP5  Test point 1  [TP_1]  (value not drawn)  (no BOM)

### Ports
3V3 (see gydrodrive_main[4B], gydrodrive_button[3B], gydrodrive_can[3B], gydrodrive_debugger[3B], gydrodrive_encoder[1A], gydrodrive_indication[3C], gydrodrive_interfaces[3C], gydrodrive_mcu[4C], gydrodrive_rs485[4B], gydrodrive_sto[2B], gydrodrive_supply[5B]), GND (see gydrodrive_main[4B], gydrodrive_button[3C], gydrodrive_can[3C], gydrodrive_control[3B], gydrodrive_currentSource[2B], gydrodrive_debugger[4C], gydrodrive_discreteControl[3B], gydrodrive_encoder[1B], gydrodrive_i2c[5C], gydrodrive_indication[3C], gydrodrive_interfaces[3A], gydrodrive_linearPosSensor[2C], gydrodrive_mcu[6D], gydrodrive_reservedPins[2C], gydrodrive_rs485[3B], gydrodrive_sensor[3C], gydrodrive_sensors[2B], gydrodrive_sto[2C], gydrodrive_supply[2C], gydrodrive_uart[4C]), TRIM_RES (out, see gydrodrive_main[3B], gydrodrive_mcu[3B])

### Nets
3V3: J2.1 ; port 3V3
GND: J2.3 ; port GND
TRIM_RES: J2.2 TP5.1 ; port TRIM_RES

### Notes on the sheet
- Подп. и дата
- Инв. № дубл.
- Взам. инв. №
- Инв. № подл.
- Изм.
- Лист
- № докум.
- Подп.
- Дата
- Копировал
- Формат
- A4

### Library data of the parts
J2 = DG142V-5.08-03P: Клеммник 3-контактный, шаг 5.08 мм; Part Name: Клеммник DG142V-5.08-03P; Parameters: 8А; Max Price: 60; System: Connector; Part Number: DG142V-5.08-03P; Component Type: Standart; Pin Count: 3
TP5 = Test point 1: Тестовый контакт круглый 1 мм; Part Number: Test point 1; Part Name: Тестовый контакт; Component Type: Standart (No BOM)

## Sheet gydrodrive_control.SchDoc
size 297 x 209 mm; SheetNumber: 11; SheetTotal: 22
Used 2 times, as channels C1, C2. Parts and nets are listed once, with the designators drawn on the sheet.
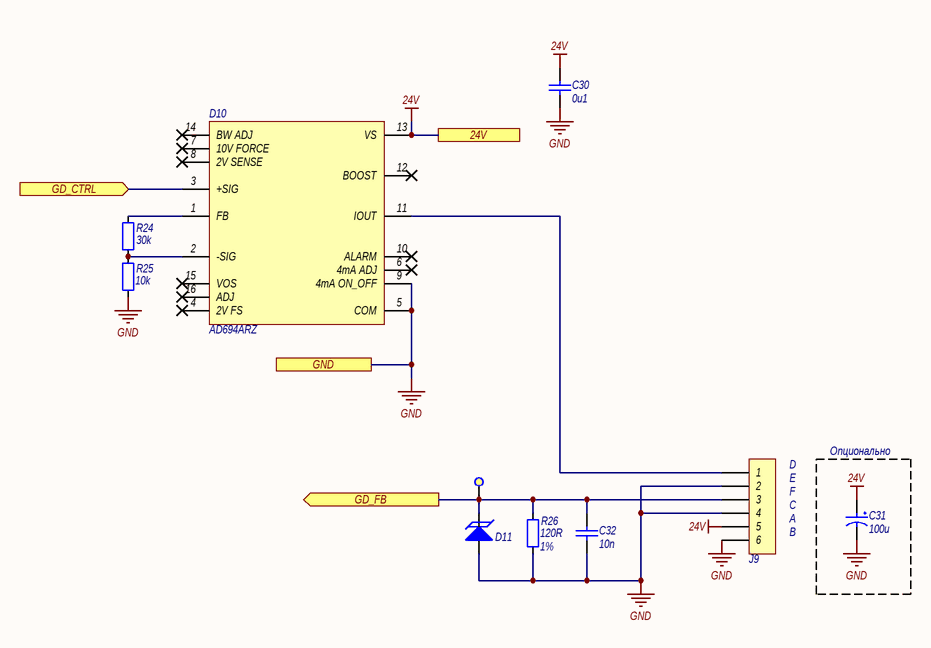
[diagram p7: gydrodrive_control.SchDoc]

### Parts
C30  Capacitance: 0u1  [CAPC2012-0805M]  (hidden comment: CAP_0805)
C31  Capacitance: 100u  [ECAP811.5]  (hidden comment: TKR101M1HF11)
C32  Capacitance: 10n  [CAPC2012-0805M]  (hidden comment: CAP_0805)
D10  AD694ARZ  [SO16W_M]
D11  SMBJ3V3-E3/52  [SMB_M]  (value not drawn)
J9  DG142V-5.08-06P  [DG142V-5.08-06P]  (value not drawn)
R24  Resistance: 30k  [RESC2012-0805M]  (hidden comment: RES_0805)
R25  Resistance: 10k  [RESC2012-0805M]  (hidden comment: RES_0805)
R26  Resistance: 120R  Tolerance: 1%  [RESC2012-0805M]  (hidden comment: RES_0805)
TP8  Test point 1  [TP_1]  (value not drawn)  (no BOM)

### Blocks framed on the sheet
Опционально: C31

### Ports
24V (see gydrodrive_main[4A], gydrodrive_button[2B], gydrodrive_currentSource[2B], gydrodrive_discreteControl[4B], gydrodrive_encoder[3B], gydrodrive_linearPosSensor[3B], gydrodrive_sensor[3B], gydrodrive_sensors[2B], gydrodrive_sto[3B], gydrodrive_supply[2B]), GD_CTRL (in, see gydrodrive_main[3A]), GD_FB (out, see gydrodrive_main[3A]), GND (see gydrodrive_main[4A], gydrodrive_button[2C], gydrodrive_can[3C], gydrodrive_currentSource[2B], gydrodrive_debugger[4C], gydrodrive_discreteControl[3B], gydrodrive_encoder[1B], gydrodrive_i2c[5C], gydrodrive_indication[3C], gydrodrive_inputTrim[2C], gydrodrive_interfaces[3A], gydrodrive_linearPosSensor[2C], gydrodrive_mcu[6D], gydrodrive_reservedPins[2C], gydrodrive_rs485[3B], gydrodrive_sensor[3C], gydrodrive_sensors[2B], gydrodrive_sto[2C], gydrodrive_supply[2C], gydrodrive_uart[4C])

### Nets
24V: C30.2 C31.1 D10.13(VS) J9.5 ; port 24V
GND: C30.1 C31.2 C32.1 D10.5(COM) D10.9(4mA_ON_OFF) D11.2(A) J9.2 J9.4 J9.6 R25.1 R26.1 ; port GND
GD_CTRL: D10.3(+SIG) ; port GD_CTRL
GD_FB: C32.2 D11.1(K) J9.3 R26.2 TP8.1 ; port GD_FB
NetD10_1: D10.1(FB) R24.2
NetD10_2: D10.2(-SIG) R24.1 R25.2
NetD10_11: D10.11(IOUT) J9.1

Not connected (* = marked no-connect by the designer): D10 4(2V_FS)* 6(4mA_ADJ)* 7(10V_FORCE)* 8(2V_SENSE)* 10(ALARM)* 12(BOOST)* 14(BW_ADJ)* 15(VOS)* 16(ADJ)*

### Channels
C1: designators end in _1; ports 24V=24V GD_CTRL=GD_CTRL1 GD_FB=GD_FB1 GND=GND
C2: designators end in _2; ports 24V=24V GD_CTRL=GD_CTRL2 GD_FB=GD_FB2 GND=GND

### Notes on the sheet
- (near J9) D
- (near J9) E
- F
- C
- A
- B
- Подп. и дата
- Инв. № дубл.
- Взам. инв. №
- Инв. № подл.
- Изм.
- Лист
- № докум.
- Подп.
- Дата
- Копировал
- Формат
- A4

### Library data of the parts
C30 = CAPC_0805: as C1 on sheet gydrodrive_mcu; Part Number: CAPC_0805; Part Name: ='Конд-р керам. 0805,  '  + Parameters; Component Type: Standart; Pin Count: 2
C31 = TKR101M1HF11: Конденсатор электролитический; Part Name: Конд-р электрол.  TKR101M1HF11, 100uF, 50V; Parameters: 100uF, 50V; Voltage: 50V; Max Price: 20; Part Number: TKR101M1HF11; Component Type: Standart
C32 = CAPC_0805: Конденсатор керамический, корпус 0805; Parameters: 10n,  50V; Voltage: 50V; Max Price: 5; Part Number: CAPC_0805; Part Name: ='Конд-р керам. 0805,  '  + Parameters; Component Type: Standart; Pin Count: 2
D10 = AD694ARZ: Part Name: Передатчик 4-20mA AD694ARZ; Max Price: 1500; Part Number: AD694ARZ; Component Type: Standart
D11 = SMBJ3V3-E3/52: Защитный диод (TVS); Part Name: Защитный диод SMBJ3V3-E3/52; Parameters: 3V3, 600W; Voltage: 3V3; Max Price: 40; Part Number: SMBJ3V3-E3/52; Component Type: Standart; Pin Count: 0
J9 = DG142V-5.08-06P: Клеммник 6-контактный, шаг 5.08 мм; Part Name: Клеммник DG142V-5.08-06P; Parameters: 8А; Max Price: 60; System: Connector; Part Number: DG142V-5.08-06P; Component Type: Standart; Pin Count: 6
R24 = RESC_0805: as R2 on sheet gydrodrive_supply; Part Number: RESC_0805; Part Name: ='Рез-р 0805, ' + Parameters; Component Type: Standart
R25 = RESC_0805: as R45 on sheet gydrodrive_mcu; Part Number: RESC_0805; Part Name: ='Рез-р 0805, ' + Parameters; Component Type: Standart
R26 = RESC_0805: Рез-р, корпус 0805; Parameters: 120R, 1%; Max Price: 3; Part Number: RESC_0805; Part Name: ='Рез-р 0805, ' + Parameters; Component Type: Standart
TP8 = Test point 1: Тестовый контакт круглый 1 мм; Part Number: Test point 1; Part Name: Тестовый контакт; Component Type: Standart (No BOM)

## Sheet gydrodrive_indication.SchDoc
size 297 x 209 mm; SheetNumber: 10; SheetTotal: 22
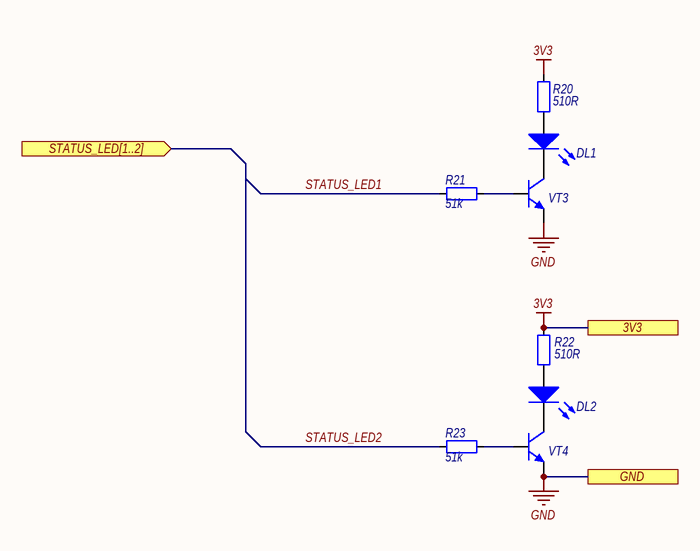
[diagram p8: gydrodrive_indication.SchDoc]

### Parts
DL1  LED_0805  [LEDC2012-0805M]  (value not drawn)
DL2  LED_0805  [LEDC2012-0805M]  (value not drawn)
R20  Resistance: 510R  [RESC2012-0805M]  (hidden comment: RES_0805)
R21  Resistance: 51k  [RESC2012-0805M]  (hidden comment: RES_0805)
R22  Resistance: 510R  [RESC2012-0805M]  (hidden comment: RES_0805)
R23  Resistance: 51k  [RESC2012-0805M]  (hidden comment: RES_0805)
VT3  BC817  [SOT23-3M]  (value not drawn)
VT4  BC817  [SOT23-3M]  (value not drawn)

### Ports
3V3 (see gydrodrive_main[4B], gydrodrive_button[3B], gydrodrive_can[3B], gydrodrive_debugger[3B], gydrodrive_encoder[1A], gydrodrive_inputTrim[4B], gydrodrive_interfaces[3C], gydrodrive_mcu[4C], gydrodrive_rs485[4B], gydrodrive_sto[2B], gydrodrive_supply[5B]), GND (see gydrodrive_main[4B], gydrodrive_button[3C], gydrodrive_can[3C], gydrodrive_control[3B], gydrodrive_currentSource[2B], gydrodrive_debugger[4C], gydrodrive_discreteControl[3B], gydrodrive_encoder[1B], gydrodrive_i2c[5C], gydrodrive_inputTrim[4C], gydrodrive_interfaces[3A], gydrodrive_linearPosSensor[2C], gydrodrive_mcu[6D], gydrodrive_reservedPins[2C], gydrodrive_rs485[3B], gydrodrive_sensor[3C], gydrodrive_sensors[2B], gydrodrive_sto[2C], gydrodrive_supply[2C], gydrodrive_uart[4C]), STATUS_LED[1..2] (in, see gydrodrive_main[3B], gydrodrive_mcu[1B])

### Nets
3V3: R20.1 R22.1 ; port 3V3
GND: VT3.2(E) VT4.2(E) ; port GND
STATUS_LED1: R21.2
STATUS_LED2: R23.2
NetDL1_1: DL1.1(K) VT3.3(C)
NetDL1_2: DL1.2(A) R20.2
NetDL2_1: DL2.1(K) VT4.3(C)
NetDL2_2: DL2.2(A) R22.2
NetR21_1: R21.1 VT3.1(B)
NetR23_1: R23.1 VT4.1(B)

### Notes on the sheet
- Подп. и дата
- Инв. № дубл.
- Взам. инв. №
- Инв. № подл.
- Изм.
- Лист
- № докум.
- Подп.
- Дата
- Копировал
- Формат
- A4

### Library data of the parts
DL1 DL2 = LED_0805: as DL3 on sheet gydrodrive_supply; Part Number: LED_0805; Component Type: Standart; Pin Count: 2
R20 R22 = RESC_0805: Рез-р, корпус 0805; Tolerance: 5%; Parameters: 510R, 5%; Max Price: 3; Part Number: RESC_0805; Part Name: ='Рез-р 0805, ' + Parameters; Component Type: Standart
R21 R23 = RESC_0805: Рез-р, корпус 0805; Tolerance: 5%; Parameters: 51k, 5%; Max Price: 3; Part Number: RESC_0805; Part Name: ='Рез-р 0805, ' + Parameters; Component Type: Standart
VT3 VT4 = BC817: Биполярный транзистор; Part Name: Транзистор BC817; Parameters: 45V, 0.5A; Voltage: 45V; Current: 500 mA; Max Price: 20; Part Number: BC817; Component Type: Standart

## Sheet gydrodrive_discreteControl.SchDoc
size 297 x 209 mm; SheetNumber: 7; SheetTotal: 22
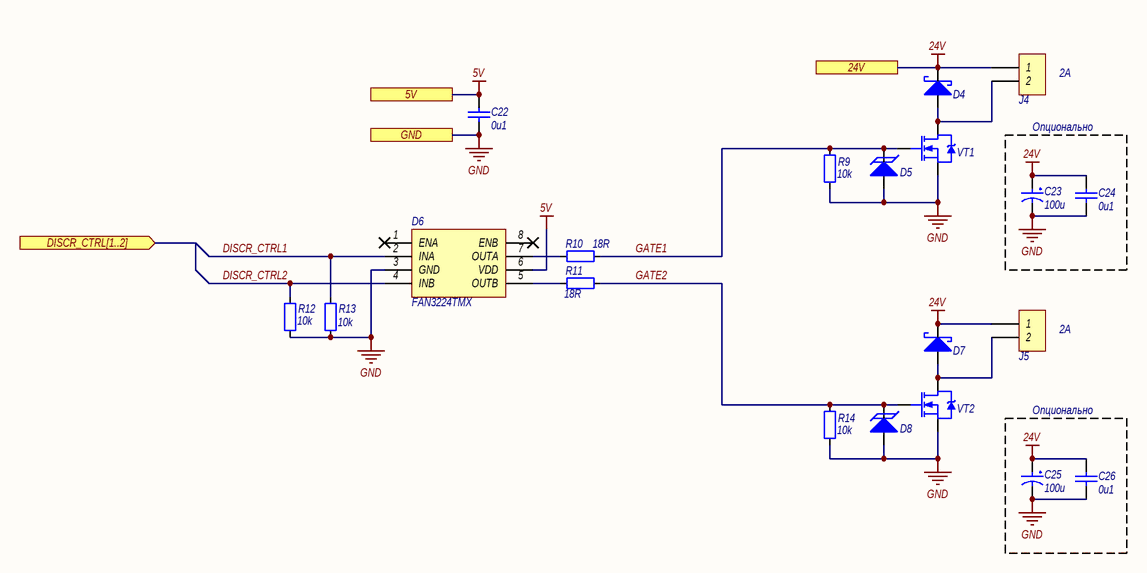
[diagram p9: gydrodrive_discreteControl.SchDoc]

### Parts
C22  Capacitance: 0u1  [CAPC2012-0805M]  (hidden comment: CAP_0805)
C23  Capacitance: 100u  [ECAP811.5]  (hidden comment: TKR101M1HF11)
C24  Capacitance: 0u1  [CAPC3216-1206M]  (hidden comment: CAP_1206)
C25  Capacitance: 100u  [ECAP811.5]  (hidden comment: TKR101M1HF11)
C26  Capacitance: 0u1  [CAPC3216-1206M]  (hidden comment: CAP_1206)
D4  SS24  [SMB_M]  (value not drawn)
D5  SMAJ12A  [SMA_M]  (value not drawn)
D6  FAN3224TMX  [SO8_M]
D7  SS24  [SMB_M]  (value not drawn)
D8  SMAJ12A  [SMA_M]  (value not drawn)
J4  DG142V-5.08-02P  [DG142V-5.08-02P]  (value not drawn)
J5  DG142V-5.08-02P  [DG142V-5.08-02P]  (value not drawn)
R9  Resistance: 10k  [RESC2012-0805M]  (hidden comment: RES_0805)
R10  Resistance: 18R  [RESC2012-0805M]  (hidden comment: RES_0805)
R11  Resistance: 18R  [RESC2012-0805M]  (hidden comment: RES_0805)
R12  Resistance: 10k  [RESC2012-0805M]  (hidden comment: RES_0805)
R13  Resistance: 10k  [RESC2012-0805M]  (hidden comment: RES_0805)
R14  Resistance: 10k  [RESC2012-0805M]  (hidden comment: RES_0805)
VT1  20N06  [TO-252AA_M]  (value not drawn)
VT2  20N06  [TO-252AA_M]  (value not drawn)

### Blocks framed on the sheet
Опционально: C23 C24
Опционально: C25 C26

### Ports
5V (see gydrodrive_main[1B], gydrodrive_can[4B], gydrodrive_currentSource[1C], gydrodrive_interfaces[3C], gydrodrive_supply[3B]), 24V (see gydrodrive_main[1A], gydrodrive_button[2B], gydrodrive_control[2B], gydrodrive_currentSource[1B], gydrodrive_encoder[3B], gydrodrive_linearPosSensor[2B], gydrodrive_sensor[2B], gydrodrive_sensors[1B], gydrodrive_sto[3B], gydrodrive_supply[2C]), DISCR_CTRL[1..2] (in, see gydrodrive_main[1B], gydrodrive_mcu[1B]), GND (see gydrodrive_main[1B], gydrodrive_button[2C], gydrodrive_can[3C], gydrodrive_control[2C], gydrodrive_currentSource[1B], gydrodrive_debugger[3C], gydrodrive_encoder[1B], gydrodrive_i2c[5C], gydrodrive_indication[3C], gydrodrive_inputTrim[2C], gydrodrive_interfaces[3A], gydrodrive_linearPosSensor[2C], gydrodrive_mcu[6D], gydrodrive_reservedPins[2C], gydrodrive_rs485[3B], gydrodrive_sensor[2C], gydrodrive_sensors[1B], gydrodrive_sto[2C], gydrodrive_supply[2C], gydrodrive_uart[4C])

### Nets
5V: C22.2 D6.6(VDD) ; port 5V
24V: C23.1 C24.2 C25.1 C26.2 D4.1(K) D7.1(K) J4.1 J5.1 ; port 24V
GND: C22.1 C23.2 C24.1 C25.2 C26.1 D5.2(A) D6.3(GND) D8.2(A) R9.1 R12.1 R13.1 R14.1 VT1.3(S) VT2.3(S) ; port GND
DISCR_CTRL1: D6.2(INA) R13.2
DISCR_CTRL2: D6.4(INB) R12.2
GATE1: D5.1(K) R9.2 R10.1 VT1.1(G)
GATE2: D8.1(K) R11.1 R14.2 VT2.1(G)
NetD4_2: D4.2(A) J4.2 VT1.2(D)
NetD6_5: D6.5(OUTB) R11.2
NetD6_7: D6.7(OUTA) R10.2
NetD7_2: D7.2(A) J5.2 VT2.2(D)

Not connected (* = marked no-connect by the designer): D6 1(ENA)* 8(ENB)*

### Notes on the sheet
- (near J4) 2А
- (near J5) 2А
- Подп. и дата
- Инв. № дубл.
- Взам. инв. №
- Инв. № подл.
- Изм.
- Лист
- № докум.
- Подп.
- Дата
- Копировал
- Формат
- A4

### Library data of the parts
C22 = CAPC_0805: as C1 on sheet gydrodrive_mcu; Part Number: CAPC_0805; Part Name: ='Конд-р керам. 0805,  '  + Parameters; Component Type: Standart; Pin Count: 2
C23 C25 = TKR101M1HF11: as C31 on sheet gydrodrive_control; Part Number: TKR101M1HF11; Component Type: Standart
C24 C26 = CAPC_1206: Конденсатор керамический, корпус 1206; Parameters: 0u1,  50V; Voltage: 50V; Max Price: 12; Part Number: CAPC_1206; Part Name: ='Конд-р керам. 1206,  '  + Parameters; Component Type: Standart; Pin Count: 2
D4 D7 = SS24: Диод Шоттки; Part Name: Диод Шоттки SS24; Parameters: 40V, 2A; Voltage: 40V; Current: 2A; Max Price: 15; Part Number: SS24; Component Type: Standart; Pin Count: 2
D5 D8 = SMAJ12A: Защитный диод (TVS); Part Name: Защитный диод SMAJ12A; Parameters: 12V, 400W; Voltage: 12V; Max Price: 40; Power: 400W; Part Number: SMAJ12A; Component Type: Standart; Pin Count: 2
D6 = FAN3224TMX: Сдвоенный драйвер ключей нижнего уровня; Part Name: MOSFET драйвер FAN3224TMX; Parameters: 4.5..18V, 5A, LL; Configuration: LL; Supply Voltage: 4.5..18V; Current: 5A; Max Price: 300; Part Number: FAN3224TMX; Component Type: Standart
J4 J5 = DG142V-5.08-02P: as J1 on sheet gydrodrive_supply; Part Number: DG142V-5.08-02P; Component Type: Standart; Pin Count: 2
R9 R12-R14 = RESC_0805: as R45 on sheet gydrodrive_mcu; Part Number: RESC_0805; Part Name: ='Рез-р 0805, ' + Parameters; Component Type: Standart
R10 R11 = RESC_0805: Рез-р, корпус 0805; Tolerance: 5%; Parameters: 18R, 5%; Max Price: 3; Part Number: RESC_0805; Part Name: ='Рез-р 0805, ' + Parameters; Component Type: Standart
VT1 VT2 = 20N06: Полевой транзистор; Part Name: Транзистора 20N06; Parameters: 60V, 20A; Voltage: 60V; Current: 20A; Max Price: 20; Part Number: 20N06; Component Type: Standart

## Sheet gydrodrive_sto.SchDoc
size 297 x 209 mm; SheetNumber: 12; SheetTotal: 22
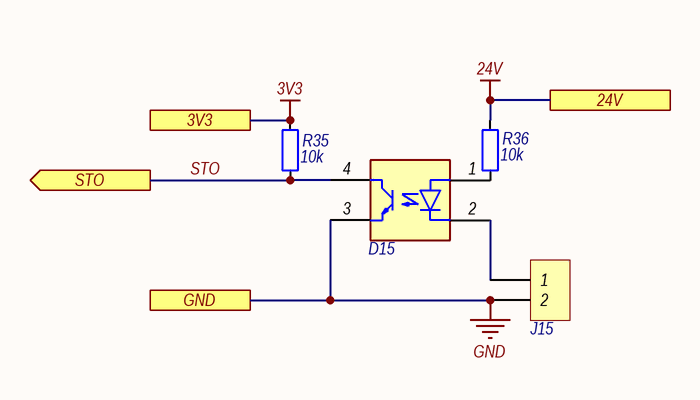
[diagram p10: gydrodrive_sto.SchDoc]

### Parts
D15  LTV-817S  [DIP-4-SMD]  (value not drawn)
J15  DG142V-5.08-02P  [DG142V-5.08-02P]  (value not drawn)
R35  Resistance: 10k  [RESC2012-0805M]  (hidden comment: RES_0805)
R36  Resistance: 10k  [RESC2012-0805M]  (hidden comment: RES_0805)

### Ports
3V3 (see gydrodrive_main[4C], gydrodrive_button[3B], gydrodrive_can[3B], gydrodrive_debugger[3B], gydrodrive_encoder[1A], gydrodrive_indication[4C], gydrodrive_inputTrim[4B], gydrodrive_interfaces[3C], gydrodrive_mcu[4C], gydrodrive_rs485[4B], gydrodrive_supply[5B]), 24V (see gydrodrive_main[4C], gydrodrive_button[4B], gydrodrive_control[4B], gydrodrive_currentSource[2B], gydrodrive_discreteControl[4B], gydrodrive_encoder[3B], gydrodrive_linearPosSensor[3B], gydrodrive_sensor[3B], gydrodrive_sensors[2B], gydrodrive_supply[2B]), GND (see gydrodrive_main[4C], gydrodrive_button[3C], gydrodrive_can[3C], gydrodrive_control[3B], gydrodrive_currentSource[2B], gydrodrive_debugger[4C], gydrodrive_discreteControl[3B], gydrodrive_encoder[1B], gydrodrive_i2c[5C], gydrodrive_indication[4C], gydrodrive_inputTrim[4C], gydrodrive_interfaces[3A], gydrodrive_linearPosSensor[2C], gydrodrive_mcu[6D], gydrodrive_reservedPins[2C], gydrodrive_rs485[3B], gydrodrive_sensor[3C], gydrodrive_sensors[2B], gydrodrive_supply[2C], gydrodrive_uart[4C]), STO (out, see gydrodrive_main[3C], gydrodrive_mcu[6B])

### Nets
3V3: R35.2 ; port 3V3
24V: R36.2 ; port 24V
GND: D15.3(C) J15.2 ; port GND
STO: D15.4(A) R35.1 ; port STO
NetD15_1: D15.1(K) R36.1
NetD15_2: D15.2(E) J15.1

### Notes on the sheet
- Подп. и дата
- Инв. № дубл.
- Взам. инв. №
- Инв. № подл.
- Изм.
- Лист
- № докум.
- Подп.
- Дата
- Копировал
- Формат
- A4

### Library data of the parts
D15 = LTV-817S: as D3 on sheet gydrodrive_button; Part Number: LTV-817S; Component Type: Standart
J15 = DG142V-5.08-02P: as J1 on sheet gydrodrive_supply; Part Number: DG142V-5.08-02P; Component Type: Standart; Pin Count: 2
R35 R36 = RESC_0805: as R45 on sheet gydrodrive_mcu; Part Number: RESC_0805; Part Name: ='Рез-р 0805, ' + Parameters; Component Type: Standart